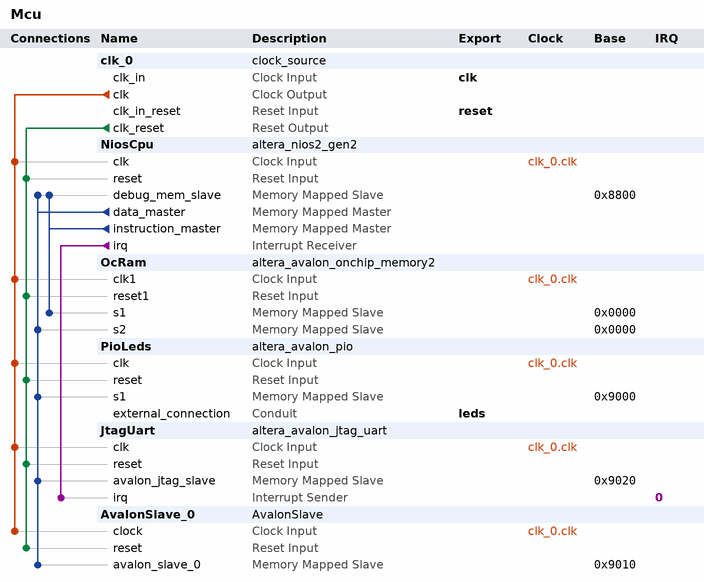
[diagram p0: system contents]
# Platform Designer (Qsys) system Mcu, Cyclone IV E EP4CE22F17C6
# Parameters at their usual value, and those the tool derives, are not listed.
package require -exact qsys 18.1
create_system Mcu
set_project_property DEVICE_FAMILY {Cyclone IV E}
set_project_property DEVICE EP4CE22F17C6

add_instance clk_0 clock_source 18.1
set_instance_parameter_value clk_0 clockFrequency 50000000

add_instance NiosCpu altera_nios2_gen2 18.1
set_instance_parameter_value NiosCpu dcache_size 2048
set_instance_parameter_value NiosCpu exceptionSlave OcRam.s1
set_instance_parameter_value NiosCpu icache_size 4096
set_instance_parameter_value NiosCpu impl Tiny
set_instance_parameter_value NiosCpu mul_32_impl 0
set_instance_parameter_value NiosCpu mul_shift_choice 1
set_instance_parameter_value NiosCpu resetSlave OcRam.s1

add_instance OcRam altera_avalon_onchip_memory2 18.1
set_instance_parameter_value OcRam dataWidth 32
set_instance_parameter_value OcRam dualPort true
set_instance_parameter_value OcRam initMemContent true
set_instance_parameter_value OcRam initializationFileName onchip_mem.hex
set_instance_parameter_value OcRam memorySize 32768
set_instance_parameter_value OcRam singleClockOperation true

add_instance PioLeds altera_avalon_pio 18.1
set_instance_parameter_value PioLeds direction Output
set_instance_parameter_value PioLeds width 8

add_instance JtagUart altera_avalon_jtag_uart 18.1
set_instance_parameter_value JtagUart simInteractiveOptions NO_INTERACTIVE_WINDOWS

add_instance AvalonSlave_0 AvalonSlave 1.0

# connections
add_connection clk_0.clk AvalonSlave_0.clock clock
add_connection clk_0.clk JtagUart.clk clock
add_connection clk_0.clk NiosCpu.clk clock
add_connection clk_0.clk OcRam.clk1 clock
add_connection clk_0.clk PioLeds.clk clock
add_connection clk_0.clk_reset AvalonSlave_0.reset reset
add_connection clk_0.clk_reset JtagUart.reset reset
add_connection clk_0.clk_reset NiosCpu.reset reset
add_connection clk_0.clk_reset OcRam.reset1 reset
add_connection clk_0.clk_reset PioLeds.reset reset
add_connection NiosCpu.data_master AvalonSlave_0.avalon_slave_0 avalon
set_connection_parameter_value NiosCpu.data_master/AvalonSlave_0.avalon_slave_0 baseAddress 0x9010
add_connection NiosCpu.data_master JtagUart.avalon_jtag_slave avalon
set_connection_parameter_value NiosCpu.data_master/JtagUart.avalon_jtag_slave baseAddress 0x9020
add_connection NiosCpu.data_master NiosCpu.debug_mem_slave avalon
set_connection_parameter_value NiosCpu.data_master/NiosCpu.debug_mem_slave baseAddress 0x8800
add_connection NiosCpu.data_master OcRam.s2 avalon
set_connection_parameter_value NiosCpu.data_master/OcRam.s2 baseAddress 0x0000
add_connection NiosCpu.data_master PioLeds.s1 avalon
set_connection_parameter_value NiosCpu.data_master/PioLeds.s1 baseAddress 0x9000
add_connection NiosCpu.instruction_master NiosCpu.debug_mem_slave avalon
set_connection_parameter_value NiosCpu.instruction_master/NiosCpu.debug_mem_slave baseAddress 0x8800
add_connection NiosCpu.instruction_master OcRam.s1 avalon
set_connection_parameter_value NiosCpu.instruction_master/OcRam.s1 baseAddress 0x0000
add_connection NiosCpu.irq JtagUart.irq interrupt
set_connection_parameter_value NiosCpu.irq/JtagUart.irq irqNumber 0

# exported interfaces
add_interface clk clock sink
set_interface_property clk EXPORT_OF clk_0.clk_in
add_interface leds conduit end
set_interface_property leds EXPORT_OF PioLeds.external_connection
add_interface reset reset sink
set_interface_property reset EXPORT_OF clk_0.clk_in_reset

set_interconnect_requirement {$system} qsys_mm.clockCrossingAdapter HANDSHAKE
set_interconnect_requirement {$system} qsys_mm.enableEccProtection FALSE
set_interconnect_requirement {$system} qsys_mm.insertDefaultSlave FALSE
set_interconnect_requirement {$system} qsys_mm.maxAdditionalLatency 1

save_system Mcu.qsys
